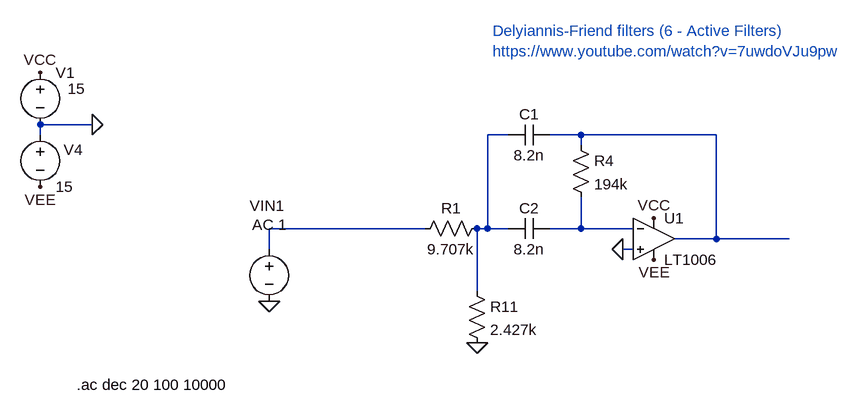
[diagram p0: schematic Draft06.asc]
Draft06.asc, the LTspice schematic file:
Version 4
SHEET 1 2756 2104
WIRE -672 -544 -752 -544
WIRE -752 -528 -752 -544
WIRE -32 -528 -64 -528
WIRE 80 -528 32 -528
WIRE 288 -528 80 -528
WIRE 80 -512 80 -528
WIRE -160 -384 -400 -384
WIRE -64 -384 -64 -528
WIRE -64 -384 -80 -384
WIRE -32 -384 -64 -384
WIRE 80 -384 80 -432
WIRE 80 -384 32 -384
WIRE 160 -384 80 -384
WIRE 288 -368 288 -528
WIRE 288 -368 224 -368
WIRE 400 -368 288 -368
WIRE -400 -352 -400 -384
WIRE 160 -352 144 -352
WIRE -80 -288 -80 -384
FLAG -752 -624 VCC
FLAG -752 -448 VEE
FLAG 192 -400 VCC
FLAG 192 -336 VEE
FLAG -672 -544 0
FLAG -400 -272 0
FLAG 144 -352 0
FLAG -80 -208 0
SYMBOL voltage -752 -640 R0
WINDOW 123 0 0 Left 0
WINDOW 39 0 0 Left 0
WINDOW 3 42 41 Left 2
SYMATTR Value 15
SYMATTR InstName V1
SYMBOL voltage -752 -544 R0
WINDOW 123 0 0 Left 0
WINDOW 39 0 0 Left 0
WINDOW 0 36 39 Left 2
SYMATTR InstName V4
SYMATTR Value 15
SYMBOL res -96 -304 R0
SYMATTR InstName R11
SYMATTR Value 2.427k
SYMBOL OpAmps\\LT1006 192 -432 R0
SYMATTR InstName U1
SYMBOL res -176 -368 R270
WINDOW 0 32 56 VTop 2
WINDOW 3 0 56 VBottom 2
SYMATTR InstName R1
SYMATTR Value 9.707k
SYMBOL cap 32 -400 R90
WINDOW 0 0 32 VBottom 2
WINDOW 3 32 32 VTop 2
SYMATTR InstName C2
SYMATTR Value 8.2n
SYMBOL cap -32 -512 R270
WINDOW 0 32 32 VTop 2
WINDOW 3 0 32 VBottom 2
SYMATTR InstName C1
SYMATTR Value 8.2n
SYMBOL voltage -400 -368 R0
WINDOW 123 -26 -22 Left 2
WINDOW 39 0 0 Left 0
WINDOW 3 -341 151 Left 2
WINDOW 0 -30 -51 Left 2
SYMATTR Value2 AC 1
SYMATTR Value ""
SYMATTR InstName VIN1
SYMBOL res 64 -528 R0
SYMATTR InstName R4
SYMATTR Value 194k
TEXT -696 -144 Left 2 !.ac dec 20 100 10000
TEXT -56 -688 Left 2 ;Delyiannis-Friend filters (6 - Active Filters)\nhttps://www.youtube.com/watch?v=7uwdoVJu9pw

The netlist it stands for:
* Draft06.asc
V1 VCC 0 15
V4 0 VEE 15
R11 N001 0 2.427k
XU1 0 N004 VCC VEE N002 LT1006  ; pins In+ In- V+ V- OUT
R1 N003 N001 9.707k
C2 N004 N001 8.2n
C1 N001 N002 8.2n
VIN1 N003 0 AC 1
R4 N002 N004 194k
.ac dec 20 100 10000
* Delyiannis-Friend filters (6 - Active Filters)
* https://www.youtube.com/watch?v=7uwdoVJu9pw
.lib LTC.lib
.backanno
.end